# Altium schematic sheet Interfaces.SchDoc: Bluebell Pod
size C; Author: DM; CompanyName: Silver Bullet Technology LLC; DrawnBy: D.McIntire; Engineer: DM; Organization: Silver Bullet Technology; Address1: Schematic; Address2: 5300 Via Andrea; Address3: Newbury Park, CA 91320; Address4: USA; DocumentNumber: BLUEBELL-POD; SheetNumber: 5; SheetTotal: 11
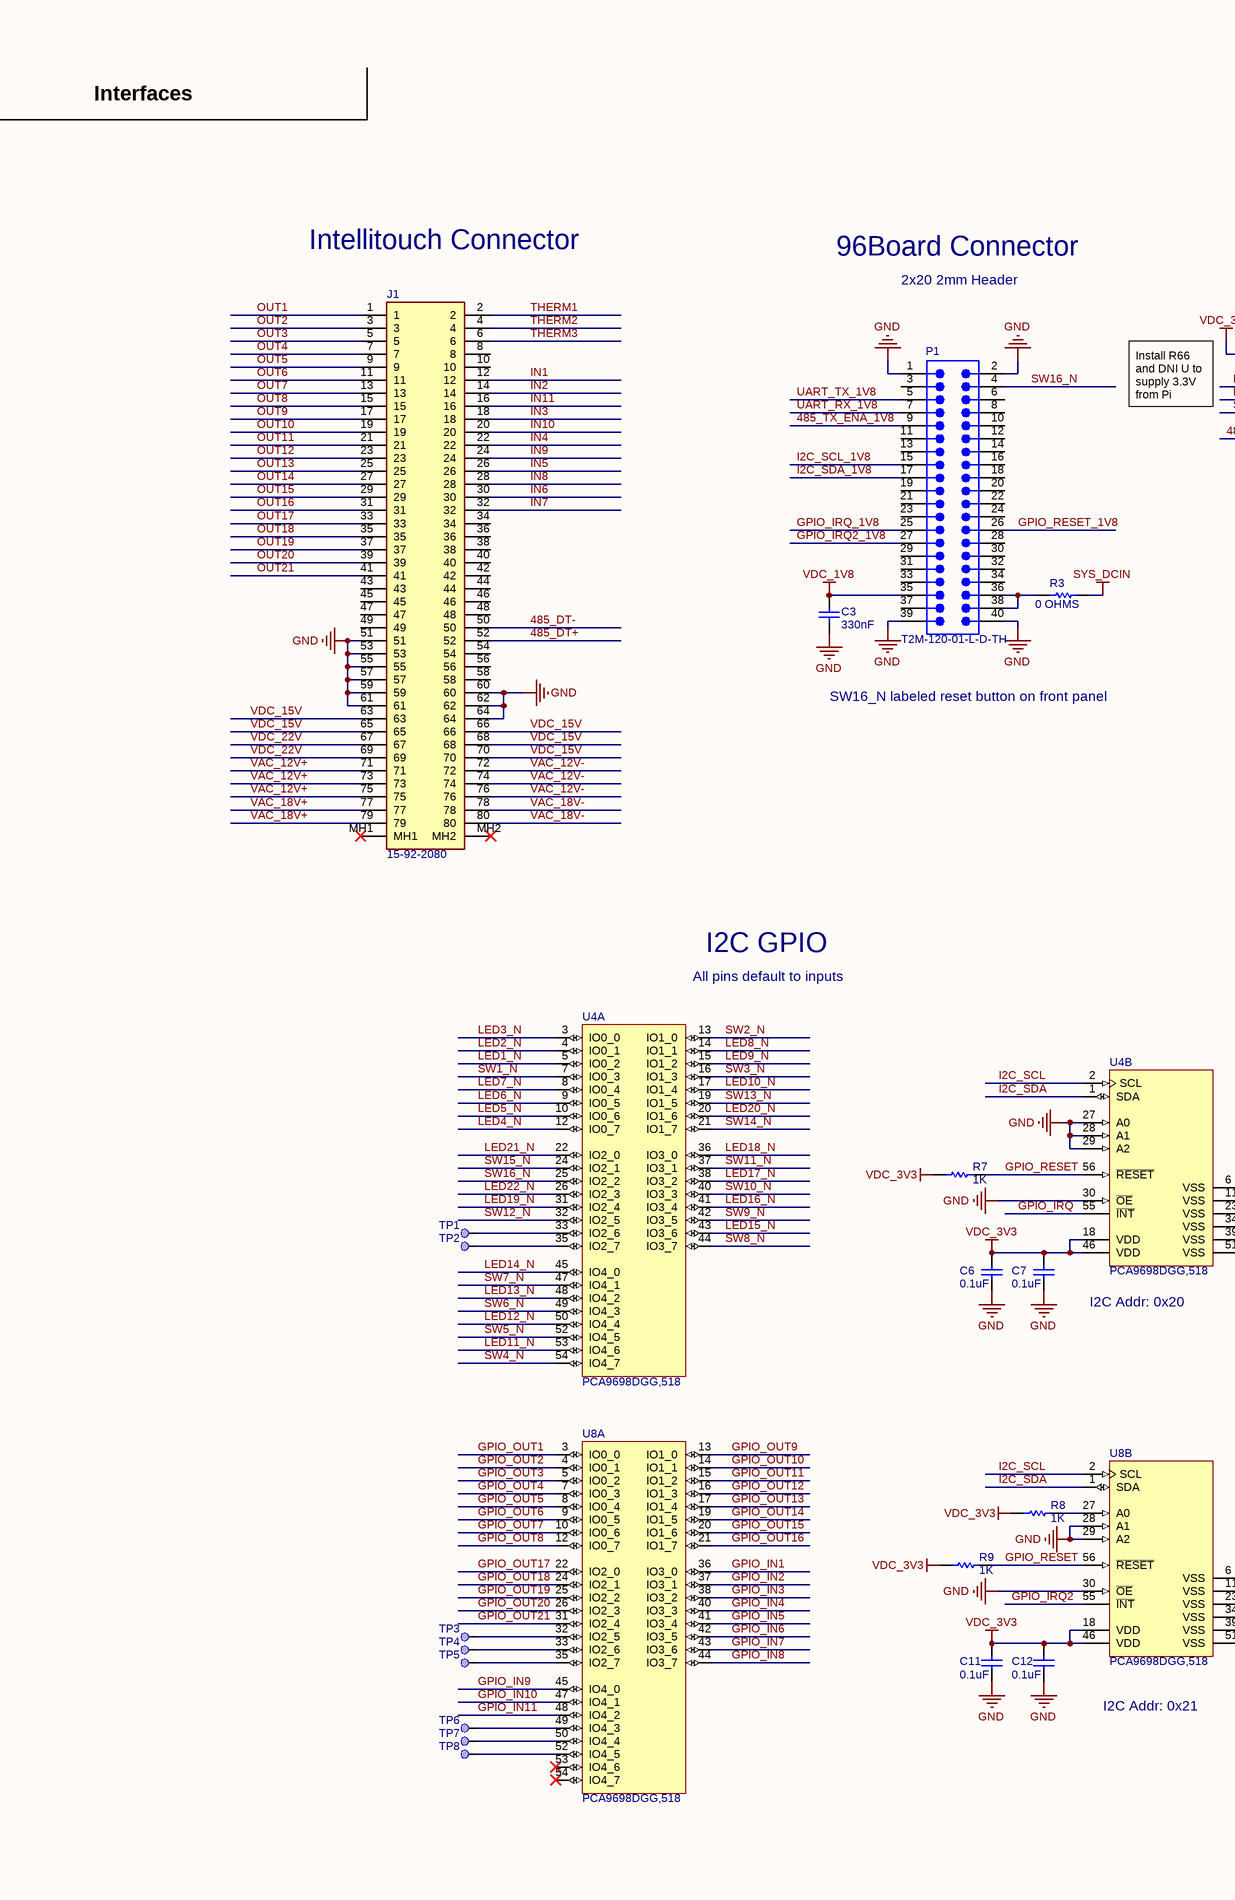
[diagram p0: Interfaces.SchDoc, left]
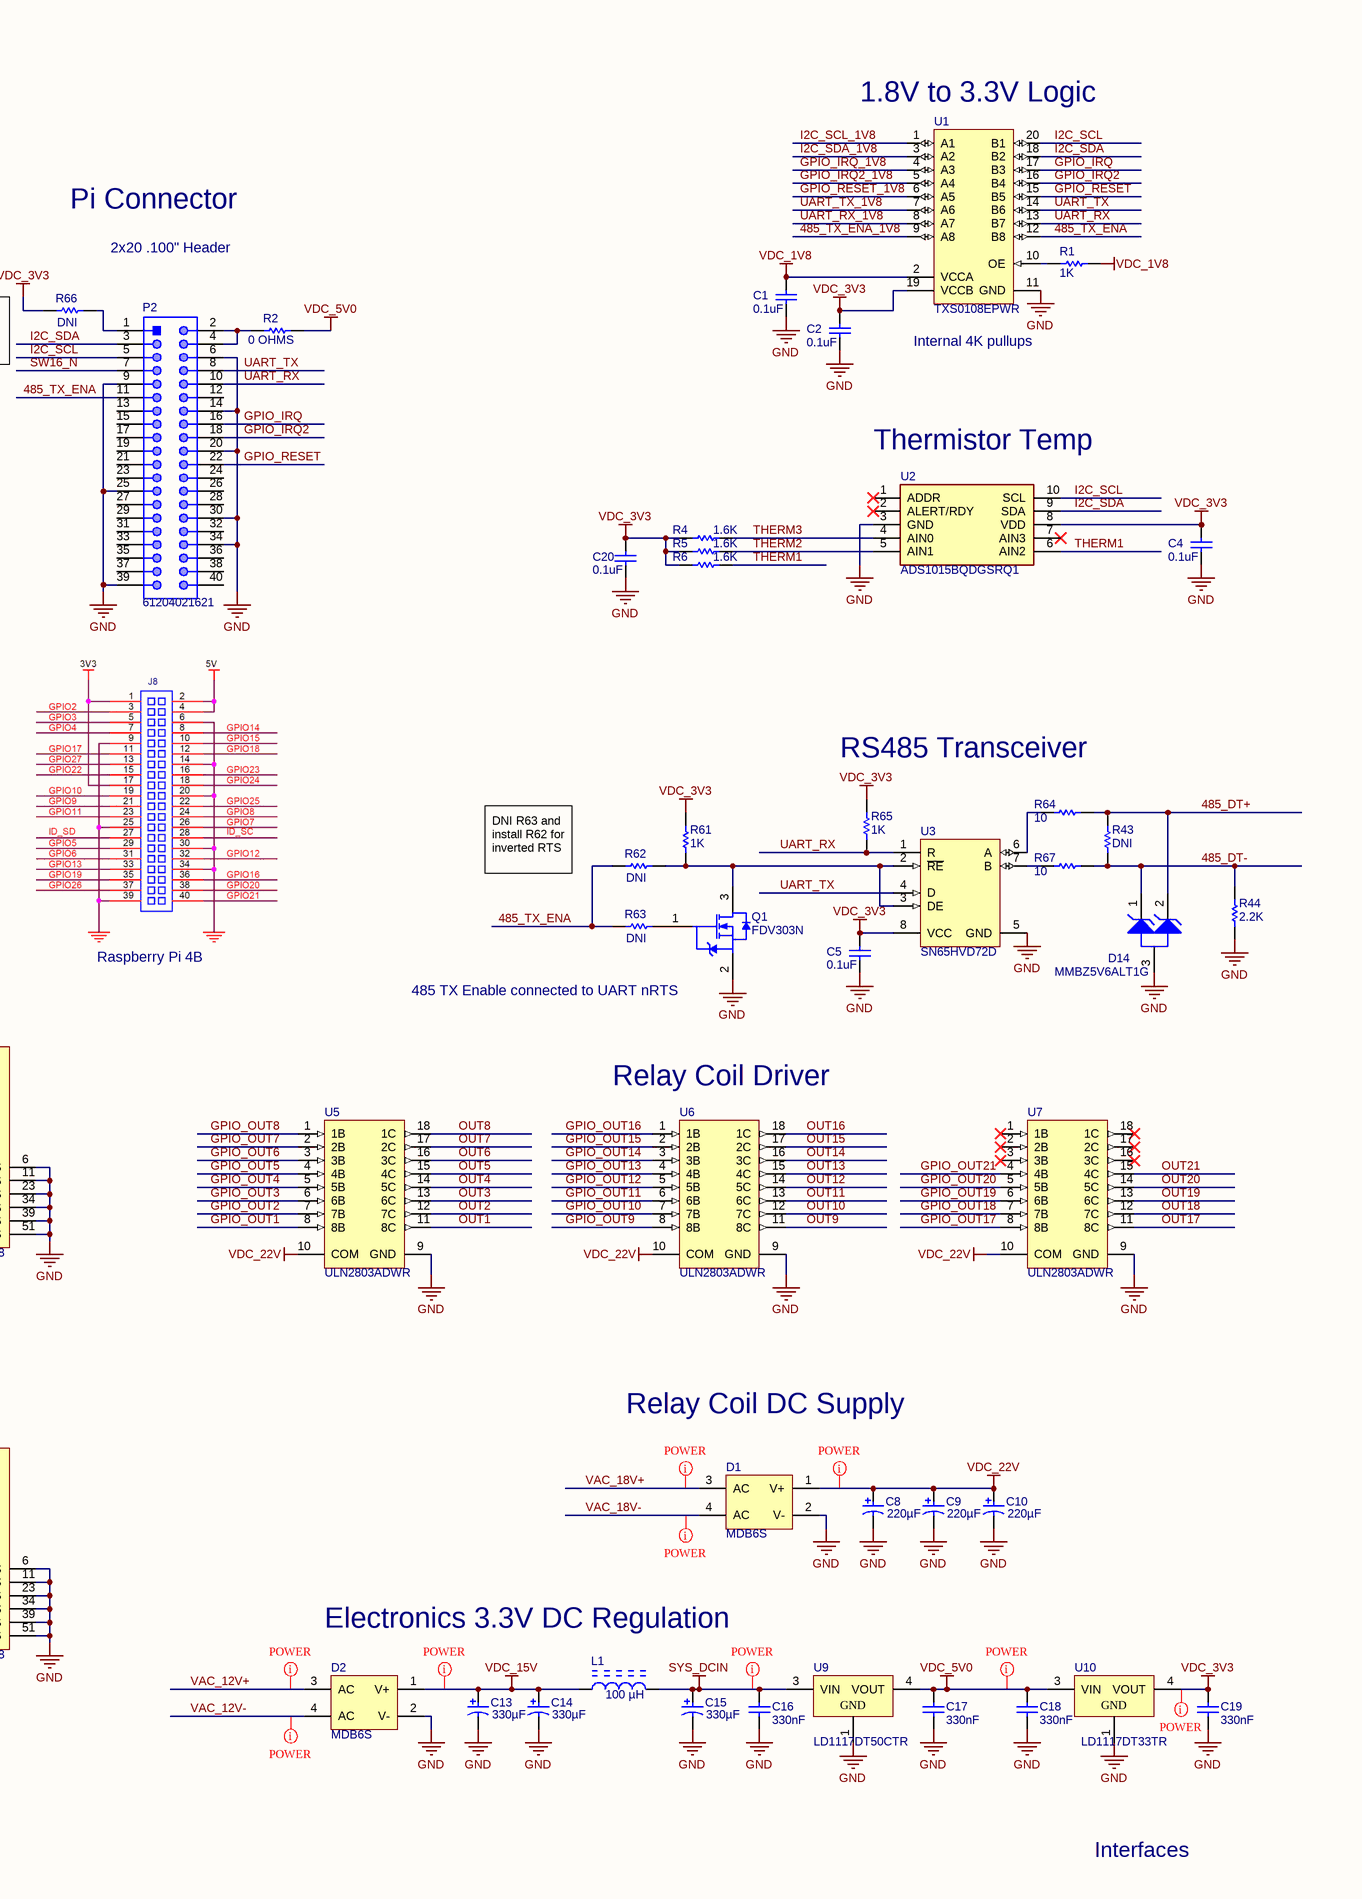
[diagram p1: Interfaces.SchDoc, right]

## Parts
C1  value 0.1uF  [CAPC1608X87X35NL15T15]  (hidden comment: C0603X104K5RACTU)
C2  value 0.1uF  [CAPC1608X87X35NL15T15]  (hidden comment: C0603X104K5RACTU)
C3  value 330nF  [CAPC0805(2012)100_M]  (hidden comment: CAP 330nF 50V 0805(2012))
C4  value 0.1uF  [CAPC1608X87X35NL15T15]  (hidden comment: C0603X104K5RACTU)
C5  value 0.1uF  [CAPC1608X87X35NL15T15]  (hidden comment: C0603X104K5RACTU)
C6  value 0.1uF  [CAPC1608X87X35NL15T15]  (hidden comment: C0603X104K5RACTU)
C7  value 0.1uF  [CAPC1608X87X35NL15T15]  (hidden comment: C0603X104K5RACTU)
C8  Capacitance: 220µF  [PNSC-EEE-1HA221P_L]  (hidden comment: EEE-1HA221P)
C9  Capacitance: 220µF  [PNSC-EEE-1HA221P_L]  (hidden comment: EEE-1HA221P)
C10  Capacitance: 220µF  [PNSC-EEE-1HA221P_L]  (hidden comment: EEE-1HA221P)
C11  value 0.1uF  [CAPC1608X87X35NL15T15]  (hidden comment: C0603X104K5RACTU)
C12  value 0.1uF  [CAPC1608X87X35NL15T15]  (hidden comment: C0603X104K5RACTU)
C13  Capacitance: 330µF  [PNSC-EEE-FK1V331P_L]  (hidden comment: EEE-FK1V331P)
C14  Capacitance: 330µF  [PNSC-EEE-FK1V331P_L]  (hidden comment: EEE-FK1V331P)
C15  Capacitance: 330µF  [PNSC-EEE-FK1V331P_L]  (hidden comment: EEE-FK1V331P)
C16  value 330nF  [CAPC0805(2012)100_M]  (hidden comment: CAP 330nF 50V 0805(2012))
C17  value 330nF  [CAPC0805(2012)100_M]  (hidden comment: CAP 330nF 50V 0805(2012))
C18  value 330nF  [CAPC0805(2012)100_M]  (hidden comment: CAP 330nF 50V 0805(2012))
C19  value 330nF  [CAPC0805(2012)100_M]  (hidden comment: CAP 330nF 50V 0805(2012))
C20  value 0.1uF  [CAPC1608X87X35NL15T15]  (hidden comment: C0603X104K5RACTU)
D1  MDB6S  [FAIR-MDBXS-4_V]
D2  MDB6S  [FAIR-MDBXS-4_V]
D14  MMBZ5V6ALT1G  [ONSC-SOT-23-3-318-08_V]
J1  15-92-2080  [15922080]
L1  Inductance: 100 µH  [BOUR-SRN8040-101M_V]  (hidden comment: SRN8040-101M)
P1  T2M-120-01-L-D-TH  [SMTC-T2M-120-01-X-D-TH]
P2  61204021621  [61204021621]
Q1  FDV303N  [FAIR-FDV303N-3_V]
R1  value 1K  [RESC1608X55X30ML15T15]  (hidden comment: ERJ-3GEYJ102V)
R2  value 0 OHMS  [RESC1608X55X30NL15T15]  (hidden comment: ERJ-3GEY0R00V)
R3  value 0 OHMS  [RESC1608X55X30NL15T15]  (hidden comment: ERJ-3GEY0R00V)
R4  value 1.6K  [RESC1608X55X30ML15T15]  (hidden comment: ERJ3EKF1601V)
R5  value 1.6K  [RESC1608X55X30ML15T15]  (hidden comment: ERJ3EKF1601V)
R6  value 1.6K  [RESC1608X55X30ML15T15]  (hidden comment: ERJ3EKF1601V)
R7  value 1K  [RESC1608X55X30ML15T15]  (hidden comment: ERJ-3GEYJ102V)
R8  value 1K  [RESC1608X55X30ML15T15]  (hidden comment: ERJ-3GEYJ102V)
R9  value 1K  [RESC1608X55X30ML15T15]  (hidden comment: ERJ-3GEYJ102V)
R43  DNI  [RESC1608X55X30LL20T20]
R44  2.2K  [RESC1005X40X25LL05T05]
R61  value 1K  [RESC1608X55X30ML15T15]  (hidden comment: ERJ-3GEYJ102V)
R62  value DNI  [RESC1608X55X30NL15T15]  (hidden comment: ERJ-3GEY0R00V)
R63  value DNI  [RESC1608X55X30NL15T15]  (hidden comment: ERJ-3GEY0R00V)
R64  10  [RESC1608X55X30ML15T15]
R65  value 1K  [RESC1608X55X30ML15T15]  (hidden comment: ERJ-3GEYJ102V)
R66  value DNI  [RESC1608X55X30NL15T15]  (hidden comment: ERJ-3GEY0R00V)
R67  10  [RESC1608X55X30ML15T15]
TP1  Testpoint  [TP/SMT]  (value not drawn)  (no BOM)
TP2  Testpoint  [TP/SMT]  (value not drawn)  (no BOM)
TP3  Testpoint  [TP/SMT]  (value not drawn)  (no BOM)
TP4  Testpoint  [TP/SMT]  (value not drawn)  (no BOM)
TP5  Testpoint  [TP/SMT]  (value not drawn)  (no BOM)
TP6  Testpoint  [TP/SMT]  (value not drawn)  (no BOM)
TP7  Testpoint  [TP/SMT]  (value not drawn)  (no BOM)
TP8  Testpoint  [TP/SMT]  (value not drawn)  (no BOM)
U1  TXS0108EPWR  [PW0020A_M]
U2  ADS1015BQDGSRQ1  [SOP50P490X110-10N]
U3  SN65HVD72D  [D0008A_M]
U4  PCA9698DGG,518  [NXP-SOT364-1_M]  (parts A,B of 2)
U5  ULN2803ADWR  [DW0018A_L]
U6  ULN2803ADWR  [DW0018A_L]
U7  ULN2803ADWR  [DW0018A_L]
U8  PCA9698DGG,518  [NXP-SOT364-1_M]  (parts A,B of 2)
U9  LD1117DT50CTR  [TO-252_N]
U10  LD1117DT33TR  [TO-252_N]

## Nets
GND: C1.1 C2.1 C3.1 C4.1 C5.1 C6.1 C7.1 C8.2 C9.2 C10.2 C11.1 C12.1 C13.2 C14.2 C15.2 C16.1 C17.1 C18.1 C19.1 C20.1 D1.2(V-) D2.2(V-) D14.3(A) J1.51 J1.53 J1.55 J1.57 J1.59 J1.60 J1.61 J1.62 J1.64 P1.1 P1.2 P1.39 P1.40 P2.6 P2.9 P2.14 P2.20 P2.25 P2.30 P2.34 P2.39 Q1.2(S) R44.1 U1.11(GND) U2.3(GND) U3.5(GND) U4.6(VSS) U4.11(VSS) U4.23(VSS) U4.27(A0) U4.28(A1) U4.29(A2) U4.30(~{OE}) U4.34(VSS) U4.39(VSS) U4.51(VSS) U5.9(GND) U6.9(GND) U7.9(GND) U8.6(VSS) U8.11(VSS) U8.23(VSS) U8.28(A1) U8.29(A2) U8.30(~{OE}) U8.34(VSS) U8.39(VSS) U8.51(VSS) U9.1(GND) U10.1(GND)
SYS_DCIN: C15.1 C16.2 L1.2 R3.2 U9.3(VIN)
VDC_1V8: C1.2 C3.2 P1.35 R1.1 U1.2(VCCA)
VDC_3V3: C2.2 C4.2 C5.2 C6.2 C7.2 C11.2 C12.2 C19.2 C20.2 R4.1 R5.1 R6.1 R7.1 R8.1 R9.1 R61.1 R65.1 R66.1 U1.19(VCCB) U2.8(VDD) U3.8(VCC) U4.18(VDD) U4.46(VDD) U8.18(VDD) U8.46(VDD) U10.4(VOUT)
VDC_5V0: C17.2 C18.2 R2.2 U9.4(VOUT) U10.3(VIN)
VDC_15V: C13.1 C14.1 D2.1(V+) J1.63 J1.65 J1.66 J1.68 J1.70 L1.1
VDC_22V: C8.1 C9.1 C10.1 D1.1(V+) J1.67 J1.69 U5.10(COM) U6.10(COM) U7.10(COM)
485_DT+: D14.2(K2) J1.52 R43.2 R64.2
485_DT-: D14.1(K1) J1.50 R43.1 R44.2 R67.2
485_TX_ENA: P2.11 R62.1 R63.1 U1.12(B8)
485_TX_ENA_1V8: P1.9 U1.9(A8)
GPIO_IN1: U8.36(IO3_0)
GPIO_IN2: U8.37(IO3_1)
GPIO_IN3: U8.38(IO3_2)
GPIO_IN4: U8.40(IO3_3)
GPIO_IN5: U8.41(IO3_4)
GPIO_IN6: U8.42(IO3_5)
GPIO_IN7: U8.43(IO3_6)
GPIO_IN8: U8.44(IO3_7)
GPIO_IN9: U8.45(IO4_0)
GPIO_IN10: U8.47(IO4_1)
GPIO_IN11: U8.48(IO4_2)
GPIO_IRQ: P2.16 U1.17(B3) U4.55(~{INT})
GPIO_IRQ2: P2.18 U1.16(B4) U8.55(~{INT})
GPIO_IRQ2_1V8: P1.27 U1.5(A4)
GPIO_IRQ_1V8: P1.25 U1.4(A3)
GPIO_OUT1: U5.8(8B) U8.3(IO0_0)
GPIO_OUT2: U5.7(7B) U8.4(IO0_1)
GPIO_OUT3: U5.6(6B) U8.5(IO0_2)
GPIO_OUT4: U5.5(5B) U8.7(IO0_3)
GPIO_OUT5: U5.4(4B) U8.8(IO0_4)
GPIO_OUT6: U5.3(3B) U8.9(IO0_5)
GPIO_OUT7: U5.2(2B) U8.10(IO0_6)
GPIO_OUT8: U5.1(1B) U8.12(IO0_7)
GPIO_OUT9: U6.8(8B) U8.13(IO1_0)
GPIO_OUT10: U6.7(7B) U8.14(IO1_1)
GPIO_OUT11: U6.6(6B) U8.15(IO1_2)
GPIO_OUT12: U6.5(5B) U8.16(IO1_3)
GPIO_OUT13: U6.4(4B) U8.17(IO1_4)
GPIO_OUT14: U6.3(3B) U8.19(IO1_5)
GPIO_OUT15: U6.2(2B) U8.20(IO1_6)
GPIO_OUT16: U6.1(1B) U8.21(IO1_7)
GPIO_OUT17: U7.8(8B) U8.22(IO2_0)
GPIO_OUT18: U7.7(7B) U8.24(IO2_1)
GPIO_OUT19: U7.6(6B) U8.25(IO2_2)
GPIO_OUT20: U7.5(5B) U8.26(IO2_3)
GPIO_OUT21: U7.4(4B) U8.31(IO2_4)
GPIO_RESET: P2.22 R7.2 R9.2 U1.15(B5) U4.56(~{RESET}) U8.56(~{RESET})
GPIO_RESET_1V8: P1.26 U1.6(A5)
I2C_SCL: P2.5 U1.20(B1) U2.10(SCL) U4.2(SCL) U8.2(SCL)
I2C_SCL_1V8: P1.15 U1.1(A1)
I2C_SDA: P2.3 U1.18(B2) U2.9(SDA) U4.1(SDA) U8.1(SDA)
I2C_SDA_1V8: P1.17 U1.3(A2)
IN1: J1.12
IN2: J1.14
IN3: J1.18
IN4: J1.22
IN5: J1.26
IN6: J1.30
IN7: J1.32
IN8: J1.28
IN9: J1.24
IN10: J1.20
IN11: J1.16
LED1_N: U4.5(IO0_2)
LED2_N: U4.4(IO0_1)
LED3_N: U4.3(IO0_0)
LED4_N: U4.12(IO0_7)
LED5_N: U4.10(IO0_6)
LED6_N: U4.9(IO0_5)
LED7_N: U4.8(IO0_4)
LED8_N: U4.14(IO1_1)
LED9_N: U4.15(IO1_2)
LED10_N: U4.17(IO1_4)
LED11_N: U4.53(IO4_6)
LED12_N: U4.50(IO4_4)
LED13_N: U4.48(IO4_2)
LED14_N: U4.45(IO4_0)
LED15_N: U4.43(IO3_6)
LED16_N: U4.41(IO3_4)
LED17_N: U4.38(IO3_2)
LED18_N: U4.36(IO3_0)
LED19_N: U4.31(IO2_4)
LED20_N: U4.20(IO1_6)
LED21_N: U4.22(IO2_0)
LED22_N: U4.26(IO2_3)
OUT1: J1.1 U5.11(8C)
OUT2: J1.3 U5.12(7C)
OUT3: J1.5 U5.13(6C)
OUT4: J1.7 U5.14(5C)
OUT5: J1.9 U5.15(4C)
OUT6: J1.11 U5.16(3C)
OUT7: J1.13 U5.17(2C)
OUT8: J1.15 U5.18(1C)
OUT9: J1.17 U6.11(8C)
OUT10: J1.19 U6.12(7C)
OUT11: J1.21 U6.13(6C)
OUT12: J1.23 U6.14(5C)
OUT13: J1.25 U6.15(4C)
OUT14: J1.27 U6.16(3C)
OUT15: J1.29 U6.17(2C)
OUT16: J1.31 U6.18(1C)
OUT17: J1.33 U7.11(8C)
OUT18: J1.35 U7.12(7C)
OUT19: J1.37 U7.13(6C)
OUT20: J1.39 U7.14(5C)
OUT21: J1.41 U7.15(4C)
SW1_N: U4.7(IO0_3)
SW2_N: U4.13(IO1_0)
SW3_N: U4.16(IO1_3)
SW4_N: U4.54(IO4_7)
SW5_N: U4.52(IO4_5)
SW6_N: U4.49(IO4_3)
SW7_N: U4.47(IO4_1)
SW8_N: U4.44(IO3_7)
SW9_N: U4.42(IO3_5)
SW10_N: U4.40(IO3_3)
SW11_N: U4.37(IO3_1)
SW12_N: U4.32(IO2_5)
SW13_N: U4.19(IO1_5)
SW14_N: U4.21(IO1_7)
SW15_N: U4.24(IO2_1)
SW16_N: P1.4 P2.7 U4.25(IO2_2)
THERM1: J1.2 R6.2 U2.6(AIN2)
THERM2: J1.4 R5.2 U2.5(AIN1)
THERM3: J1.6 R4.2 U2.4(AIN0)
UART_RX: P2.10 R65.2 U1.13(B7) U3.1(R)
UART_RX_1V8: P1.7 U1.8(A7)
UART_TX: P2.8 U1.14(B6) U3.4(D)
UART_TX_1V8: P1.5 U1.7(A6)
VAC_12V+: D2.3(AC) J1.71 J1.73 J1.75
VAC_12V-: D2.4(AC) J1.72 J1.74 J1.76
VAC_18V+: D1.3(AC) J1.77 J1.79
VAC_18V-: D1.4(AC) J1.78 J1.80
NetP1_36: P1.36 P1.38 R3.1
NetP2_1: P2.1 R66.2
NetP2_2: P2.2 P2.4 R2.1
NetQ1_1: Q1.1(G) R63.2
NetQ1_3: Q1.3(D) R61.2 R62.2 U3.2(~{RE}) U3.3(DE)
NetR1_2: R1.2 U1.10(OE)
NetR8_2: R8.2 U8.27(A0)
NetR64_1: R64.1 U3.6(A)
NetR67_1: R67.1 U3.7(B)
NetTP1_1: TP1.1 U4.33(IO2_6)
NetTP2_1: TP2.1 U4.35(IO2_7)
NetTP3_1: TP3.1 U8.32(IO2_5)
NetTP4_1: TP4.1 U8.33(IO2_6)
NetTP5_1: TP5.1 U8.35(IO2_7)
NetTP6_1: TP6.1 U8.49(IO4_3)
NetTP7_1: TP7.1 U8.50(IO4_4)
NetTP8_1: TP8.1 U8.52(IO4_5)

Not connected (* = marked no-connect by the designer): J1 8 10 34 36 38 40 42 43 44 45 46 47 48 49 54 56 58 MH1* MH2*; P1 3 6 8 10 11 12 13 14 16 18 19 20 21 22 23 24 28 29 30 31 32 33 34 37; P2 12 13 15 17 19 21 23 24 26 27 28 29 31 32 33 35 36 37 38 40; U2 1(ADDR)* 2(ALERT/RDY)* 7(AIN3)*; U7 1(1B)* 2(2B)* 3(3B)* 16(3C)* 17(2C)* 18(1C)*; U8 53(IO4_6)* 54(IO4_7)*

## Layout directives
mark named POWER: SYS_DCIN, VAC_12V+, VAC_12V-, VAC_18V+, VAC_18V-, VDC_3V3, VDC_5V0, VDC_15V, VDC_22V

## Notes on the sheet
- Interfaces
- (near U1) 1.8V to 3.3V Logic
- Intellitouch Connector
- 96Board Connector
- 2x20 2mm Header
- Pi Connector
- 2x20 .100" Header
- (near R66) Install R66 and DNI U to supply 3.3V from Pi
- (near U1) Internal 4K pullups
- (near U2) Thermistor Temp
- SW16_N labeled reset button on front panel
- RS485 Transceiver
- DNI R63 and install R62 for inverted RTS
- I2C GPIO
- All pins default to inputs
- Raspberry Pi 4B
- 485 TX Enable connected to UART nRTS
- (near U6) Relay Coil Driver
- I2C Addr: 0x20
- Relay Coil DC Supply
- Electronics 3.3V DC Regulation
- I2C Addr: 0x21
- Silver Bullet Technology LLC
- SHEET
- PROJECT
- REV
- 5300 VIA ANDREA
- NEWBURY PARK, CA 91320
- PHONE: (310) 710-7998
- EMAIL: INFO@SILVER-BULLET-TECH.COM
- SIZE
- ENGR
- C
- MODIFIED
- DOCUMENT
- /
- This document contains confidential and proprietary information. No disclosure, reproduction, or transfer of this material in part or in its entirety shall be done without prior written approval.

## Library data of the parts
C1 C2 C4-C7 C11 C12 C20 = CMP-2006-03300-1: Manufacturer: Kemet; Part Number: C0603X104K5RACTU
C3 C16-C19 = CMP-1036-04607-1: CAP 330nF 50V ±10% 0805 (2012 Metric) Thickness 1mm SMD; Case-Metric: 2012; Tolerance: Â±10%; Case-EIA: 0805; Rated Voltage: 50 V; Max Thickness: 1 mm; Technology: SMT
C8-C10 = CMP-2000-06200-1: Aluminum Electrolytic Capacitor, 220 uF, +/- 20%, 50 V, -40 to 85 degC, 2-Pin SMD, RoHS, Tape and Reel; Manufacturer: Panasonic; Lifetime @ Temperature: 2000hours@85°C; AE Capacitor Case: RadialCan-SMD; Ripple Current AC: 300mA; SVHC: ToBeAdvised; Voltage Rating: 50V; Product Range: PANASONIC-SSeries; Datasheet Version: 11/2012; Manufacturer URL: http://www.panasonic.com/; Packaging: CutTape; Life Time @ Temperature: 2000hours@85°C; Capacitor Case Style: RadialCan-SMD; Capacitance Tolerance ±: ±20%; Mounting Technology: SurfaceMount; Operating Temperature Max: 85°C; Capacitance Tolerance: ±20%; Package Description: 2-Pin Surface Mount Device, Body 10.3 x 10.3 mm; Package Reference: SMD; Diameter: 10mm; Height: 10.2mm; Operating Temperature Min: -40°C; Datasheet URL: http://datasheet.octopart.com/EEE-1HA221P-Panasonic-datasheet-13265900.pdf
C13-C15 = CMP-2000-06212-1: Aluminum Electrolytic Capacitor, 330 uF, 35 V, -55 to 105 degC, 2-Pin CAPAE, RoHS, Tape and Reel; Manufacturer: Panasonic; Type: Can; Impedance: 0.08O; Ripple Current: 850mA; Lifetime@Temperature: 2000Hrs@105°C; Rated Voltage: 35V; Datasheet Version: 07/2008; Manufacturer URL: http://www.panasonic.com/; Package Description: 2-Pin Capacitor Aluminum Electrolytic, Body 10.3 x 10.3 mm, Height 10.5 mm; Case Size/Dimension: Ø10x10.2mm; Datasheet URL: https://datasheet.ciiva.com/29313/443481-da-01-en-smd-elko-vfk-g-330-uf-35v-29313592.pdf; Series: FK; Mounting Technology: SurfaceMount; Package Reference: EEE-FK1V331P; Operating Temp-Max: 105°C; Operating Temp Range: -55to+105°C
D1 D2 = CMP-0950-00003-1: 600 V, 1 A, Single-Phase Bridge Rectifier, -55 to 150 degC, 4-Pin 5 x 4.4 x 1.6 mm MicroDIP, RoHS, Tape and Reel; Manufacturer: Fairchild Semiconductor; IR: 10 uA; VF: 1.1 V; IF (AV): 1 A; VRRM: 600 V; CJ: 10 pF; IFSM: 30 A; ComponentLink1URL: http://www.fairchildsemi.com/; PackageDescription: 4-Pin Micro Surface Mount, Body 5 x 4.4 mm, Height 1.6 mm; ComponentLink1Description: Manufacturer URL; DatasheetVersion: Rev. 1.2.1; PackageReference: MDBXS-4; ComponentLink2Description: Datasheet; ComponentLink2URL: http://www.fairchildsemi.com/ds/MD/MDB10S.pdf; Temp. Range: -55 to 150 degC; Mounting Technology: Surface Mount; PartNumber: MDB6S; Packing: Tape and Reel; RoHS: TRUE
D14 = CMP-1060-01222-1: 24 W Peak Power Zener Transient Voltage Suppressor, Dual Common Anode Zeners for ESD Protection, 3-Pin SOT-23, Pb-Free, Tape and Reel; Manufacturer: On Semiconductor; VZ Typ (V): 5.6; PackageVersion: Rev. AP, 11/2009; ComponentLink1URL: http://www.onsemi.com/; Packing: Tape and Reel; DatasheetVersion: Rev. 13; ComponentLink1Description: Manufacturer URL; ComponentLink3URL: http://www.onsemi.cn/pub_link/Collateral/318-08.PDF; ComponentLink2Description: Datasheet; PackageDescription: 3-Pin Small Outline Transistor, Body 2.92 x 1.3 mm, Pitch 0.95 mm; ComponentLink3Description: Package Specification; RoHS: Pb-Free; ComponentLink2URL: http://www.onsemi.cn/pub_link/Collateral/MMBZ5V6ALT1-D.PDF; PackageReference: SOT-23-3-318-08; Mounting Technology: Surface Mount; PartNumber: MMBZ5V6ALT1G
J1 = 15-92-2080: Connector; Manufacturer_Name: Molex; Datasheet Link: https://componentsearchengine.com/Datasheets/1/15-92-2080.pdf; Height: 9.33mm; Mouser Part Number: 538-15-92-2080; Mouser Price/Stock: https://www.mouser.com/Search/Refine.aspx?Keyword=538-15-92-2080; Manufacturer_Part_Number: 15-92-2080
L1 = CMP-2000-07143-1: Semi-Shielded Power Inductor, 100 uH, -40 to 125 degC, 2-Pin SMD, RoHS, Tape and Reel; Manufacturer: Bourns; Tolerance: ±20 / %; Brand/Series: SRN8040Series; Current, Rating: 1 / A; Manufacturer URL: http://www.bourns.com/; Package Description: 2-Pin Surface Mount Device, Body 8 x 8 mm; Datasheet URL: http://www.produktinfo.conrad.com/datenblaetter/1000000-1099999/001056456-da-01-en-MAG_ABG_LEIST_IND_SRN8040_101M_100UH_SMD.pdf; Datasheet Version: 08/2013; Termination: SMT; Type: Power; Mounting Technology: SurfaceMount; Package Reference: SRN8040-101M
P1 = CMP-1029-00099-1: High Reliability Cable Header, Through-hole, Vertical, -55 to 125 degC, 2 mm Pitch, 40-Pin, Male, RoHS; Manufacturer: Samtec; Pitch: 2 mm; Orientation: Vertical; ComponentLink3URL: http://www.samtec.com/documents/webfiles/cpdf/T2M-1XX-XX-X-D-XX-XX-MKT.pdf; PackageReference: T2M-120-01-X-D-TH; RoHS: True; ComponentLink2Description: Datasheet; ComponentLink1Description: Manufacturer URL; PackageVersion: V, 3/2009; ComponentLink2URL: http://d2a072wq521u33.cloudfront.net/catalog_english//t2m.pdf; PackageDescription: 2mm Shrouded Terminal Strip; DatasheetVersion: F-214; Mounting Technology: Through-hole; Temperature Range: -55 to 125 degC; PartNumber: T2M-120-01-L-D-TH; ComponentLink3Description: Package Specification; ComponentLink1URL: http://www.samtec.com
P2 = CMP-1502-00015-1: Male Box Header WR-BHD, THT, Vertical, pitch 2.54 mm, 40 pins; Manufacturer: Wurth Elektronik; Pin Number: 40; Pitch: 2.54mm; Contact Resistance: 20mOhm; Withstanding Voltage: 500VAC; Working Voltage: 250VAC; Published Date: August2018; Part Number: 61204021621; Manufacturer URL: http://www.we-online.de; Gender: Male; Publisher: WurthElektronik; Packaging: Tray; Orientation: Vertical; Mounting Technology: THT; Operating Temperature: -40to125degC; Package Reference: 61204021621; Datasheet URL: https://katalog.we-online.de/em/datasheet/6120xx21621.pdf
Q1 = CMP-2000-05111-1: N-Channel MOSFET Transistor, 8 V VGSS, 25 V VDSS, 0.68 A, -55 to 150 degC, 3-Pin SOT23, RoHS, Tape and Reel; Manufacturer: Fairchild; Typical Turn-On Delay Time: 3ns; Channel Mode: Enhancement; RDS-on: 450@4.5VmOhm; Maximum Continuous Drain Current: 0.68A; Maximum Drain Source Voltage: 25V; Rad Hard: No; Typical Fall Time: 13ns; Channel Type: N; Typical Turn-Off Delay Time: 17ns; Maximum Gate Source Voltage: 8V; Typical Rise Time: 8.5ns; Mounting: SurfaceMount; Packaging: Tape&Reel; Manufacturer URL: https://www.fairchildsemi.com/; Datasheet URL: https://datasheet.ciiva.com/22681/1845307-22681736.pdf; Package: 3SOT-23; Category: MOSFET; Operating Temperature: -55to150degC; Datasheet Version: Rev. D2, 07/2014
R1 R7-R9 R61 R65 = CMP-2000-00703-1: Manufacturer: Panasonic; Part Number: ERJ-3GEYJ102V
R2 R3 R62 R63 R66 = CMP-2000-00700-1: Manufacturer: Panasonic; Part Number: ERJ-3GEY0R00V
R4-R6 = CMP-2000-00270-1: Manufacturer: Panasonic; Part Number: ERJ3EKF1601V
R43 = CMP-2000-00870-1: Part Number: ERA3AEB101V; Manufacturer: Panasonic
R44 = CMP-2000-06229-1: Precision Thick Film Chip Resistor, 2.2 kOhm, 100 mW, 1%, -55 to 155 degC, 2-Pin SMD (0402), RoHS, Tape and Reel; Manufacturer: Panasonic; Resistance: 2.2kO; Temp Coefficient: ±100ppm/°C; Rated Power: 0.1W; Datasheet URL: https://datasheet.ciiva.com/11821/0900766b80f80784-11821273.pdf; Tolerance (%): ±1%; Mounting Technology: SurfaceMount; Package Description: 2-Pin Surface Mount Device, Body 1 x 0.5 mm; Manufacturer URL: http://www.panasonic.com/; Datasheet Version: 03/2011; Package Reference: 0402; Size Code: 0402
R64 R67 = CMP-2000-00195-1: Manufacturer: Panasonic; Part Number: ERJ-3EKF10R0V
TP1-TP8 = TP: TEST POINT; Manufacturer 1: N/A; Manufacturer Part Number 1: N/A; Value: Testpoint
U1 = CMP-2000-04956-1: Bidirectional Voltage-Level Translator for Open-Drain and Push-Pull Application, 8 bit, 1.2 to 3.6 V, -40 to 85 degC, 20-Pin TSSOP, Green (RoHS & no Sb/Br), Tape and Reel; Manufacturer: Texas Instruments; Logic Type: VoltageLevelTranslator; Output Current: 620µA; Propagation Delay: 4.8ns; Supply Voltage Min: 1.2V; No. of Inputs: 8; Supply Voltage Max: 5.5V; SVHC: NoSVHC(16-Jun-2014); No. of Pins: 20; Datasheet URL: https://datasheet.ciiva.com/14287/txs0108e-14287280.pdf; Operating Temperature Min: -40degC; Logic Case Style: TSSOP; Packaging: CutTape; Datasheet Version: Rev. B, 09/2008; MSL: MSL1-Unlimited; Manufacturer URL: http://www.ti.com/; Operating Temperature Max: 85degC
U2 = ADS1015BQDGSRQ1: Integrated Circuit; Manufacturer_Name: Texas Instruments; Datasheet Link: http://www.ti.com/lit/gpn/ads1015-q1; Height: 1.1mm; Manufacturer_Part_Number: ADS1015BQDGSRQ1; Mouser Part Number: 595-ADS1015BQDGSRQ1; Mouser Price/Stock: https://www.mouser.com/Search/Refine.aspx?Keyword=595-ADS1015BQDGSRQ1; Supplier 1: Digi-Key
U3 = CMP-0694-00006-2: 3.3 V Supply RS-485 with IEC ESD Protection, 0.25 Mbps, -40 to 125 degC, 8-Pin SOIC, RoHS, Tube; Manufacturer: Texas Instruments; No. of TX: 1; VI: -7 to 12 V; ESD: 15 kV; Signaling Rate (Max) (Mbps): 0.25; ICC (Max) (mA): 0.95; VCC: 3 to 3.6 V; ComponentLink3URL: http://www.ti.com/lit/ds/sllse11c/sllse11c.pdf; PartNumber: SN65HVD72D; ComponentLink1URL: http://www.ti.com/; DatasheetVersion: SLLSE11C; ComponentLink2URL: http://www.ti.com/lit/ds/sllse11c/sllse11c.pdf; ComponentLink1Description: Manufacturer URL; No. of RX: 1; RoHS: TRUE; PackageDescription: 8-Pin Plastic Small Outline, Body 4.9 x 3.9 mm, Pitch 1.27 mm; ComponentLink2Description: Datasheet; PackageReference: D0008A; PackageVersion: 4040047-3/M; Mounting Technology: Surface Mount; ComponentLink3Description: Package Specification; Packing: Tube; Operating Temperature Range: -40 to 125 degC
U4 U8 = CMP-1269-00003-1: I2C-Bus I/O Port Expansion, 40-Bit, 2.3 to 5.5 V, -40 to 85 degC, 56-Pin TSSOP (SOT364-1), RoHS, Reel; Manufacturer: NXP Semiconductors; fSCL@Fast mode: 400 kHz Max.; IDD@5.5V: 3.5 mA Max.; Nr of Bits: 40; fSCL@Standard mode: 100 kHz Max.; ComponentLink3URL: http://www.nxp.com/documents/outline_drawing/sot364-1_po.pdf; Mounting Technology: Surface Mount; ComponentLink1URL: http://www.nxp.com/; Operating Temperature Range: -40 to 85 degC; ComponentLink2URL: http://www.nxp.com/documents/data_sheet/PCA9505_9506.pdf; VDD: 2.3 to 5.5 V; PackageDescription: 56-Pin Plastic Thin Shrink Small Outline Package, Body 14 x 6.1 mm, Pitch 0.50 mm; ComponentLink3Description: Package Specification; ComponentLink1Description: Manufacturer URL; PartNumber: PCA9698DGG,518; DatasheetVersion: Rev. 4; ComponentLink2Description: Datasheet; RoHS: TRUE; Packing: Reel; PackageVersion: Feb-03
U5-U7 = CMP-2000-07354-1: Darlington Transistor Array, -40 to 85 degC, 18-Pin SOIC (DW), Green (RoHS & no Sb/Br), Tape and Reel; Manufacturer: Texas Instruments; Package Version: 4040000-3/G, 01/2011; Other Names: 296-15777-6; Voltage - Supply: 5V; IR Max: 50uA; Number of Drivers/Receivers: 8/0; VF: 1.7V; Dynamic Catalog: DarlingtonArrays; Package Description: 18-Pin Plastic Small Outline, Body 11.55 x 7.5 mm, Pitch 1.27 mm; Mounting Technology: SurfaceMount; Packaging: Digi-Reel®; Protocol: -; Family: Interface-Drivers,Receivers,Transceivers; Package Reference: DW18; Mounting Type: SurfaceMount; Type: DarlingtonArray; Category: IntegratedCircuits(ICs); Series: -; PartNumber: ULN2803A; Manufacturer URL: http://www.ti.com/; Package / Case: 18-SOIC(0.295",7.50mmWidth); Standard Package: 1; Datasheet Version: Rev. G, 01/2015; Supplier Device Package: 18-SOIC; Package URL: http://www.ti.com/lit/ml/mpds172a/mpds172a.pdf; Datasheet URL: http://www.ti.com/lit/ds/symlink/uln2803a.pdf
U9 = CMP-0244-00109-1: Fixed Low Drop Positive Voltage Regulator, 5V, 3-Pin DPAK, Tape and Reel; ComponentLink2URL: http://www.st.com/internet/com/TECHNICAL_RESOURCES/TECHNICAL_LITERATURE/DATASHEET/CD00000544.pdf; ComponentLink1URL: http://www.st.com; PackageReference: TO-252; DatasheetVersion: 1/11/2011; ComponentLink1Description: Manufacturer URL; PackageVersion: 2011; ComponentLink2Description: Datasheet; PackageDescription: 3-Pin Transistor Outline Package 2.28 mm Pitch, 9.7 mm Lead Span (DPAK)
U10 = CMP-0244-00088-1: Fixed Low Drop Positive Voltage Regulator, 3.3V, 3-Pin DPAK, Tape and Reel; ComponentLink1Description: Manufacturer URL; PackageVersion: 2011; PackageReference: TO-252; ComponentLink2Description: Datasheet; ComponentLink1URL: http://www.st.com; DatasheetVersion: 1/11/2011; PackageDescription: 3-Pin Transistor Outline Package 2.28 mm Pitch, 9.7 mm Lead Span (DPAK); ComponentLink2URL: http://www.st.com/internet/com/TECHNICAL_RESOURCES/TECHNICAL_LITERATURE/DATASHEET/CD00000544.pdf